# EAGLE design icspBreakout (EAGLE 5.11)
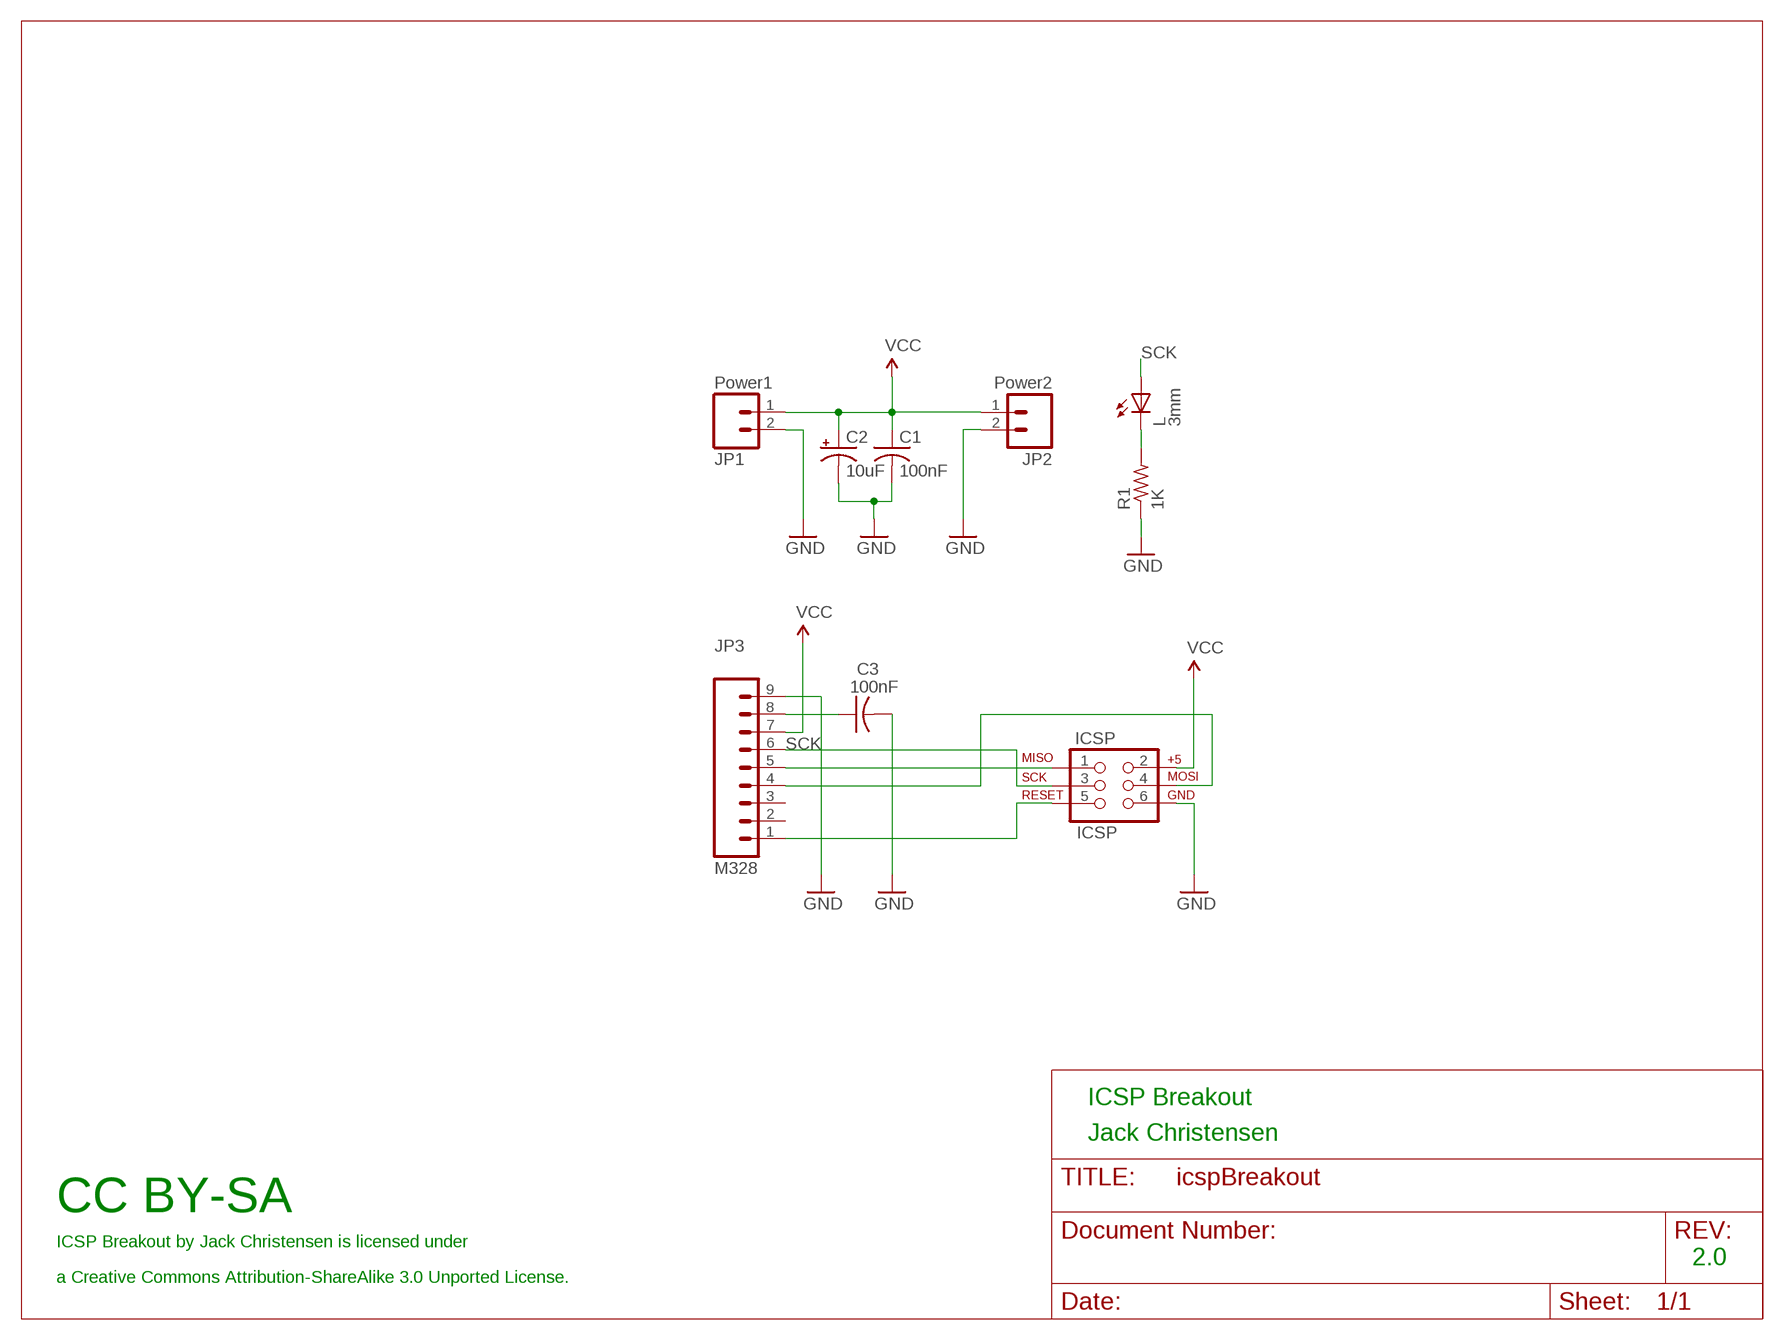
[diagram p0: schematic, sheet 1]

## Parts
C1  100nF  C-US025-025X050  [C025-025X050]
C2  10uF  CPOL-USE2.5-5  [E2,5-5]
C3  100nF  C-US025-025X050  [C025-025X050]
ICSP  ICSP  AVR_SPI_PRG_6PTH  [2X3]
JP1  Power1  M02PTH  [1X02]
JP2  Power2  M02PTH  [1X02]
JP3  M328  M09  [1X09]
L  3mm  LED3MM  [LED3MM]
R1  1K  R-US_0204/5  [0204/5]

## Nets
AREF: C3.1 JP3.8
GND: C1.2 C2.- C3.2 ICSP.6 JP1.2 JP2.2 JP3.9 R1.1
L_CATHODE: L.K(C) R1.2
MISO: ICSP.1 JP3.5
MOSI: ICSP.4 JP3.4
RESET: ICSP.5 JP3.1
SCK: ICSP.3 JP3.6 L.A
VCC: C1.1 C2.+ ICSP.2 JP1.1 JP2.1 JP3.7
Unconnected: JP3.2 JP3.3

## Notes on the sheet
- ICSP Breakout
- Jack Christensen
- CC BY-SA
- ICSP Breakout by Jack Christensen is licensed under
- 2.0
- a Creative Commons Attribution-ShareAlike 3.0 Unported License.

## Library data of the parts
C1 C3 = _jc:C-US: CAPACITOR, American symbol
C2 = rcl:CPOL-US: POLARIZED CAPACITOR, American symbol
ICSP = _jc:AVR_SPI_PRG_6: AVR ISP 6 Pin This is the reduced ISP connector for AVR programming. Common on Arduino. This footprint will take up less PCB space and can be used with a 10-pin to 6-pin adapter such as SKU: BOB-08508
JP1 JP2 = SparkFun:M02: Header 2 Standard 2-pin 0.1" header. Use with straight break away headers (SKU : PRT-00116), right angle break away headers (PRT-00553), swiss pins (PRT-00743), machine pins (PRT-00117), and female headers (PRT-00115). Molex polarized connector foot print use with SKU : PRT-08233 with associated crimp pins and housings.
JP3 = SparkFun:M09: Header 9 Standard 9-pin 0.1" header. Use with straight break away headers (SKU : PRT-00116), right angle break away headers (PRT-00553), swiss pins (PRT-00743), machine pins (PRT-00117), and female headers (PRT-00115).
L = _jc:LED: LED OSRAM: - CHIPLED LG R971, LG N971, LY N971, LG Q971, LY Q971, LO R971, LY R971 LH N974, LH R974 LS Q976, LO Q976, LY Q976 LO Q996 - Hyper CHIPLED LW Q18S LB Q993, LB Q99A, LB R99A - SideLED LS A670, LO A670, LY A670, LG A670, LP A670 LB A673, LV A673, LT A673, LW A673 LH A674 LY A675 LS A676, LA A676, LO A676, LY A676, LW A676 LS A679, LY A679, LG A679 - Hyper Micro SIDELED® LS Y876, LA Y876, LO Y876, LY Y876 LT Y87S - SmartLED LW L88C, LW L88S LB L89C, LB L89S, LG L890 LS L89K, LO L89K, LY L89K LS L896, LA L896, LO L896, LY L896 - TOPLED LS T670, LO T670, LY T670, LG T670, LP T670 LSG T670, LSP T670, LSY T670, LOP T670, LYG T670 LG T671, LOG T671, LSG T671 LB T673, LV T673, LT T673, LW T673 LH T674 LS T676, LA T676, LO T676, LY T676, LB T676, LH T676, LSB T676, LW T676 LB T67C, LV T67C, LT T67C, LS T67K, LO T67K, LY T67K, LW E67C LS E67B, LA E67B, LO E67B, LY E67B, LB E67C, LV E67C, LT E67C LW T67C LS T679, LY T679, LG T679 LS T770, LO T770, LY T770, LG T770, LP T770 LB T773, LV T773, LT T773, LW T773 LH T774 LS E675, LA E675, LY E675, LS T675 LS T776, LA T776, LO T776, LY T776, LB T776 LHGB T686 LT T68C, LB T68C - Hyper Mini TOPLED® LB M676 - Mini TOPLED Santana® LG M470 LS M47K, LO M47K, LY M47K Source: http://www.osram.convergy.de/
R1 = _jc:R-US_: RESISTOR, American symbol

## Board
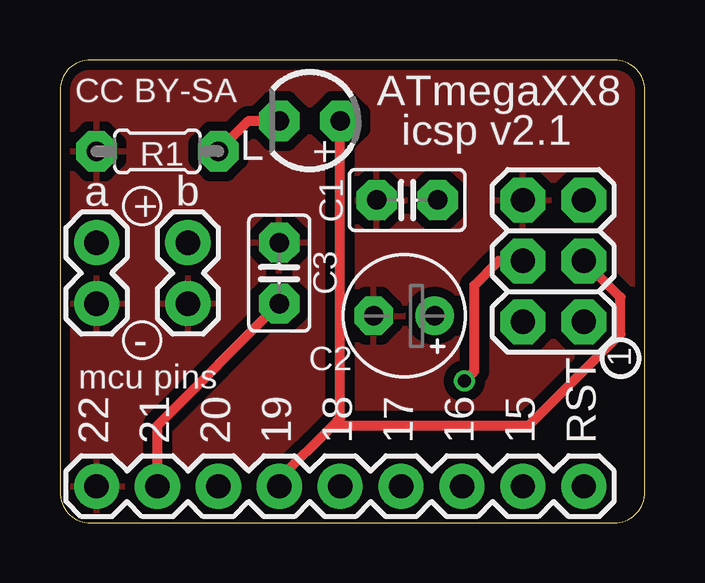
[diagram p1: board, top side]
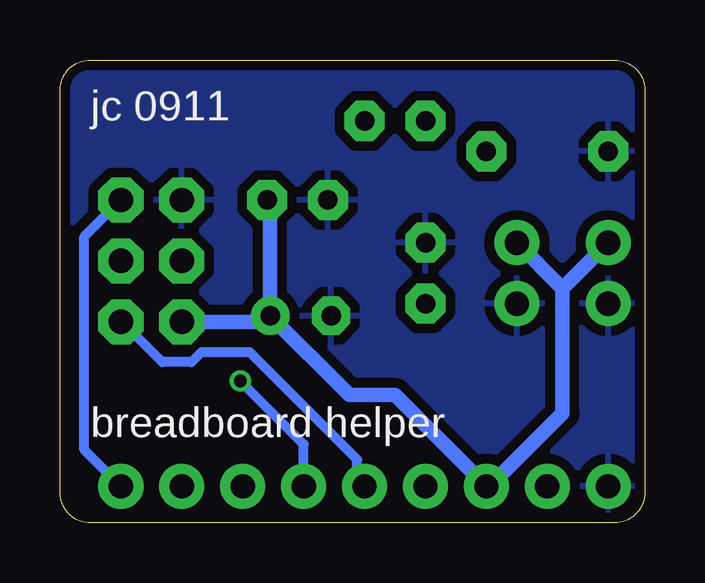
[diagram p2: board, bottom side, seen from below]

Size 24.38 x 19.3 mm. Coordinates in mm from the lower left corner, seen from the top.
Outline: 24.38,18.03 arc90 23.11,19.3 1.27,19.3 arc90 0,18.03 0,1.27 arc90 1.27,0 23.11,0 arc90 24.38,1.27 24.38,18.03
Copper layers (1*16): Top 0.0356mm / dielectric 1.5011mm / Bottom 0.0356mm
Design rules "LaenPCBOrder *": minimum track width 6mil, minimum drill 13mil, track to track 6mil, track to pad 6mil, pad to pad 6mil, via to via 6mil, smd to smd 6mil, copper to edge 15mil, drill to drill 6mil, minimum pad ring 7mil, minimum via ring 7mil, stop-mask expansion 4mil, vias tented up to drill 0mil, thermal gap 16mil

### Footprints (pad centres in the part's own frame; a part is rotated, then mirrored left to right if it is on the bottom)
C025-025X050 = drill 0.813 pad 1.676 octagon: 1 -1.27,0; 2 1.27,0
E2,5-5 = drill 0.813 pad 1.6 round: + -1.27,0 | drill 0.813 pad 1.6 octagon: - 1.27,0
2X3 = drill 1.016 pad 1.88 octagon: 1 0,0; 2 0,2.54; 3 2.54,0; 4 2.54,2.54; 5 5.08,0; 6 5.08,2.54
1X02 = drill 1.016 pad 1.88 round: 1 0,0; 2 2.54,0
1X09 = drill 1.016 pad 1.88 round: 1 0,0; 2 2.54,0; 3 5.08,0; 4 7.62,0; 5 10.16,0; 6 12.7,0; 7 15.24,0; 8 17.78,0; 9 20.32,0
LED3MM = drill 0.813 pad 1.676 octagon: A -1.27,0; K 1.27,0
0204/5 = drill 0.813 pad 1.676 octagon: 1 -2.54,0; 2 2.54,0

### Placement (x,y rotation side)
C1  14.48,13.46 180 top
C2  14.35,8.64 180 top
C3  9.14,10.41 90 top
ICSP  21.84,8.38 90 top
JP1  1.52,11.68 270 top
JP2  5.33,11.68 270 top
JP3  21.84,1.52 180 top
L  10.41,16.76 180 top
R1  4.06,15.49 0 top

### Tracks (layer width: path | path; a pad name or v marks a point on that pad's centre or on a via)
AREF
  Top 0.406: JP3.8 4.06,4.06 C3.1
GND
  pour Bottom (isolate 0.406): 1.52,19.3 23.11,19.3 arc-90 24.38,18.03 24.38,1.02 arc-90 23.37,0 1.27,0 arc-90 0,1.27 0,18.03 arc-90 1.27,19.3
  pour Top (isolate 0.406): 1.27,19.3 23.11,19.3 arc-90 24.38,18.03 24.38,1.27 arc-90 23.11,0 1.27,0 arc-90 0,1.27 0,18.29 arc-90 1.02,19.3
L_CATHODE
  Top 0.406: L.K 7.87,16.76 R1.2
MISO
  Bottom 0.406: JP3.5 11.99,1.83 11.99,2.64 16.46,7.11 18.49,7.11 18.9,6.71 20.12,6.71 21.74,8.33 ICSP.1
MOSI  (via drill 0.53)
  Top 0.406: ICSP.4 18.29,10.92 17.27,9.91 17.27,6.33 v16.87,5.92
  Bottom 0.406: JP3.4 14.22,3.28 v16.87,5.92
RESET
  Bottom 0.406: ICSP.5 23.37,11.94 23.37,3.05 JP3.1
SCK
  Top 0.406: ICSP.3 23.37,9.4 23.37,7.87 19.56,4.06 11.38,4.06 | JP3.6 9.14,1.83 11.38,4.06 | L.A 11.68,4.37 11.38,4.06
VCC
  Bottom 0.61: 3.43,9.78 JP1.1 | 3.43,9.78 3.43,4.57 6.48,1.52 JP3.7 10.41,5.33 12.32,5.33 C2.+ | 3.43,9.78 JP2.1 | C1.1 15.62,13.34 C2.+ | C2.+ 15.87,8.38 ICSP.2

### Text on the board
tPlace: CC BY-SA | ATmegaXX8 | icsp v2.1 | a | + | b | - | mcu pins | 22 | 21 | 20 | 19 | 18 | 17 | 16 | 15 | RST
bPlace: jc 0911 | breadboard helper